# Altium schematic sheet Steering PCB.SchDoc
size B; Organization: Altium Limited; Address1: L3, 12a Rodborough Rd; Address2: Frenchs Forest; Address3: NSW; Address4: Australia 2086
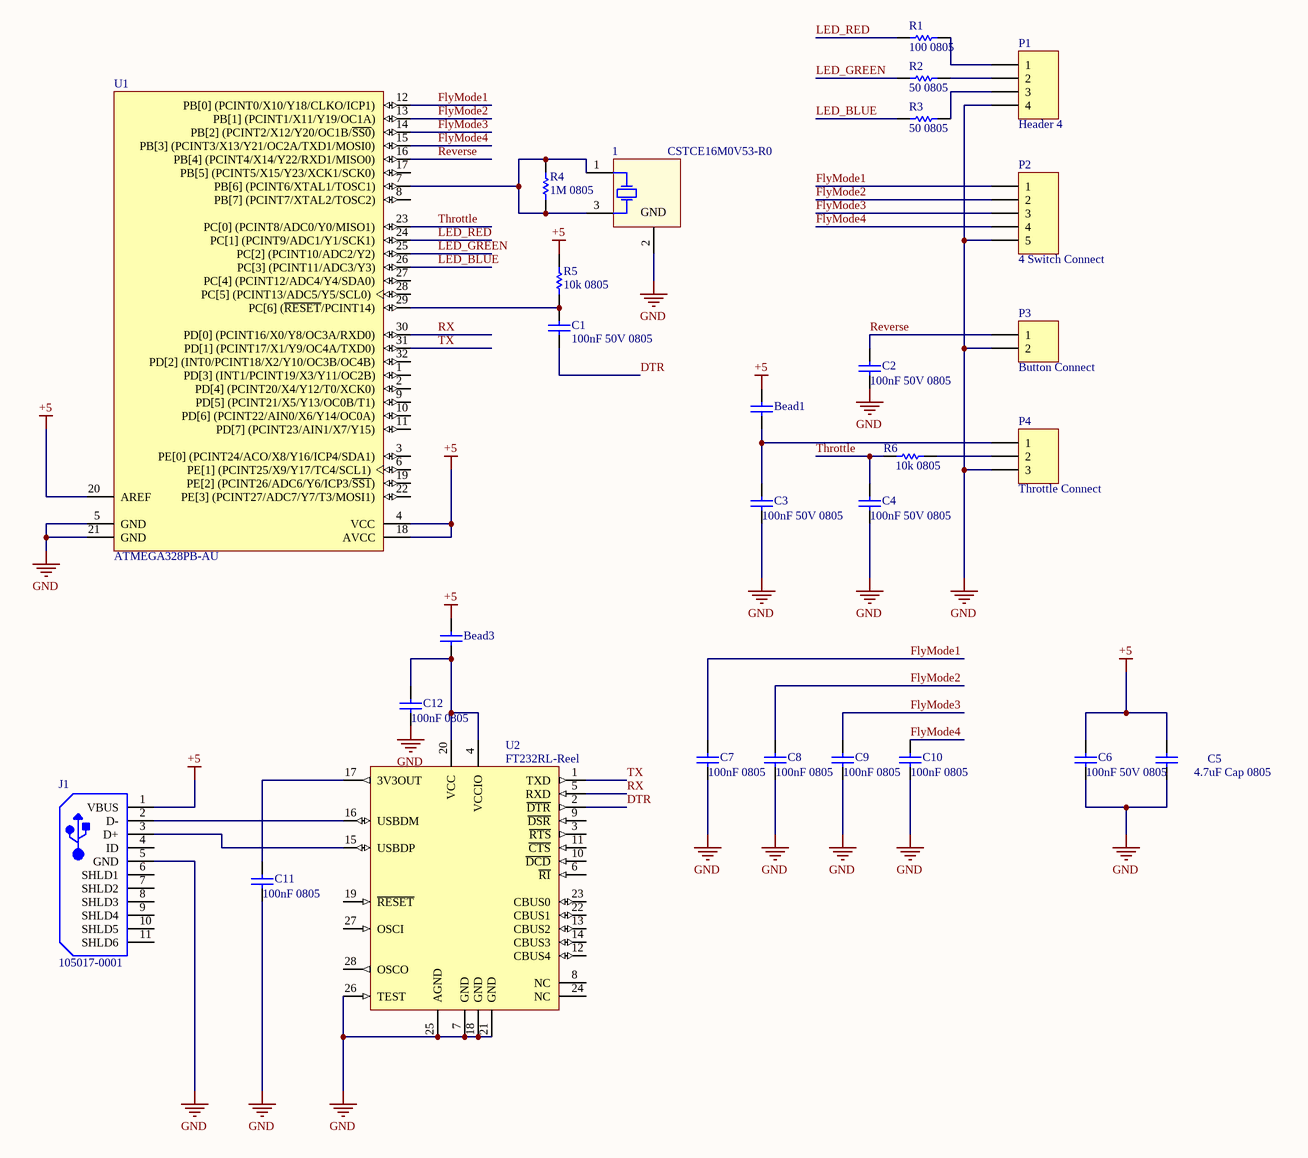
[diagram p0: Steering PCB.SchDoc]

## Parts
1  CSTCE16M0V53-R0  [MURA-CSTCE_V-3_V]
Bead1  100nF 50V 0805  [0805C_L]  (value not drawn)
Bead3  100nF 50V 0805  [0805C_L]  (value not drawn)
C1  100nF 50V 0805  [0805C_L]
C2  100nF 50V 0805  [0805C_L]
C3  100nF 50V 0805  [0805C_L]
C4  100nF 50V 0805  [0805C_L]
C5  4.7uF Cap 0805  [0805C_L]
C6  100nF 50V 0805  [0805C_L]
C7  100nF 0805  [0805C_L]
C8  100nF 0805  [0805C_L]
C9  100nF 0805  [0805C_L]
C10  100nF 0805  [0805C_L]
C11  100nF 0805  [0805C_L]
C12  100nF 0805  [0805C_L]
J1  105017-0001  [USB-MICRO-B_V]
P1  Header 4  [HDR1X4]
P2  4 Switch Connect  [HDR1X5]
P3  Button Connect  [HDR1X2]
P4  Throttle Connect  [HDR1X3]
R1  100 0805  [RESC0805(2012)_M]
R2  50 0805  [RESC0805(2012)_M]
R3  50 0805  [RESC0805(2012)_M]
R4  1M 0805  [RESC0805(2012)_M]
R5  10k 0805  [RESC0805(2012)_M]
R6  10k 0805  [RESC0805(2012)_M]
U1  ATMEGA328PB-AU  [ATML-32A_L]
U2  FT232RL-Reel  [SSOP-28_N]

## Nets
+5: Bead1.2 Bead3.2 C5.2 C6.2 J1.1(VBUS) R5.2 U1.4(VCC) U1.18(AVCC) U1.20(AREF)
GND: 1.2(GND) C2.1 C3.1 C4.1 C5.1 C6.1 C7.1 C8.1 C9.1 C10.1 C11.1 C12.1 J1.5(GND) P1.4 P2.5 P3.2 P4.3 U1.5(GND) U1.21(GND) U2.7(GND) U2.18(GND) U2.21(GND) U2.25(AGND) U2.26(TEST)
DTR: C1.1 U2.2(~{DTR})
FlyMode1: C7.2 P2.1 U1.12(PB[0]_(PCINT0/X10/Y18/CLKO/ICP1))
FlyMode2: C8.2 P2.2 U1.13(PB[1]_(PCINT1/X11/Y19/OC1A))
FlyMode3: C9.2 P2.3 U1.14(PB[2]_(PCINT2/X12/Y20/OC1B/~{SS0}))
FlyMode4: C10.2 P2.4 U1.15(PB[3]_(PCINT3/X13/Y21/OC2A/TXD1/MOSI0))
LED_BLUE: R3.2 U1.26(PC[3]_(PCINT11/ADC3/Y3))
LED_GREEN: R2.2 U1.25(PC[2]_(PCINT10/ADC2/Y2))
LED_RED: R1.2 U1.24(PC[1]_(PCINT9/ADC1/Y1/SCK1))
Reverse: C2.2 P3.1 U1.16(PB[4]_(PCINT4/X14/Y22/RXD1/MISO0))
RX: U1.30(PD[0]_(PCINT16/X0/Y8/OC3A/RXD0)) U2.5(RXD)
Throttle: C4.2 R6.2 U1.23(PC[0]_(PCINT8/ADC0/Y0/MISO1))
TX: U1.31(PD[1]_(PCINT17/X1/Y9/OC4A/TXD0)) U2.1(TXD)
Net1_1: 1.1(C1) 1.3(C2) R4.1 R4.2 U1.7(PB[6]_(PCINT6/XTAL1/TOSC1))
NetBead1_1: Bead1.1 C3.2 P4.1
NetBead3_1: Bead3.1 C12.2 U2.4(VCCIO) U2.20(VCC)
NetC1_2: C1.2 R5.1 U1.29(PC[6]_(~{RESET}/PCINT14))
NetC11_2: C11.2 U2.17(3V3OUT)
NetJ1_2: J1.2(D-) U2.16(USBDM)
NetJ1_3: J1.3(D+) U2.15(USBDP)
NetP1_1: P1.1 R1.1
NetP1_2: P1.2 R2.1
NetP1_3: P1.3 R3.1
NetP4_2: P4.2 R6.1

Not connected (* = marked no-connect by the designer): J1 4(ID) 6(SHLD1) 7(SHLD2) 8(SHLD3) 9(SHLD4) 10(SHLD5) 11(SHLD6); U1 1(PD[3]_(INT1/PCINT19/X3/Y11/OC2B)) 2(PD[4]_(PCINT20/X4/Y12/T0/XCK0)) 3(PE[0]_(PCINT24/ACO/X8/Y16/ICP4/SDA1)) 6(PE[1]_(PCINT25/X9/Y17/TC4/SCL1)) 8(PB[7]_(PCINT7/XTAL2/TOSC2)) 9(PD[5]_(PCINT21/X5/Y13/OC0B/T1)) 10(PD[6]_(PCINT22/AIN0/X6/Y14/OC0A)) 11(PD[7]_(PCINT23/AIN1/X7/Y15)) 17(PB[5]_(PCINT5/X15/Y23/XCK1/SCK0)) 19(PE[2]_(PCINT26/ADC6/Y6/ICP3/~{SS1})) 22(PE[3]_(PCINT27/ADC7/Y7/T3/MOSI1)) 27(PC[4]_(PCINT12/ADC4/Y4/SDA0)) 28(PC[5]_(PCINT13/ADC5/Y5/SCL0)) 32(PD[2]_(INT0/PCINT18/X2/Y10/OC3B/OC4B)); U2 3(~{RTS}) 6(~{RI}) 8(NC) 9(~{DSR}) 10(~{DCD}) 11(~{CTS}) 12(CBUS4) 13(CBUS2) 14(CBUS3) 19(~{RESET}) 22(CBUS1) 23(CBUS0) 24(NC) 27(OSCI) 28(OSCO)

## Notes on the sheet
- Title
- Size:
- Date:
- B
- Number:
- Time:
- Revision:
- Sheet
- of
- File:

## Library data of the parts
1 = CMP-0588-00001-1: Ceramic Resonator, 16 MHz with Built-in Capacitance, Thickness Expander Mode, Initial Frequency Tolerance +/- 0.5%, Load Capacity 15 pF, -20 to 80 degC, 3.2 x 1.3 x 1 mm SMD, RoHS, Reel; Manufacturer: Murata; Oscillating Frequency: 16 MHz; Load Capacity: 15 pF; ComponentLink2Description: Datasheet; RoHS: TRUE; Operating Temperature Range: -20 to 80 degC; Mounting Technology: Surface Mount; PackageReference: CSTCE_V-3; Packing: Reel; ComponentLink2URL: http://www.murata.com/products/catalog/pdf/p16e.pdf; ComponentLink1URL: http://www.murata.com/; ComponentLink1Description: Manufacturer URL; DatasheetVersion: Rev. P16E-22; Initial Tolerance: +/- 0.5%; PackageDescription: 3-Pin SMD, Body 3.2 x 1.3 mm, Pitch 0.95 mm; PartNumber: CSTCE16M0V53-R0; Initial Frequency Tolerance: +/- 0.5%
Bead1 Bead3 C1-C4 C6 = Cap100nF_50V_0805: Manufacturer: Yageo; Manufacturer Part Number: CC0805ZRY5V9BB104; Capacitance: 0.1µF; Tolerance: -20%, +80%; Temperature Coefficient: Y5V (F); Catalog Drawings: CC_0805_0.6; Featured Product: Commodity Multilayer Ceramic Capacitors – CC Series; Online Catalog: CC Series; Other Names: 311-1361-6; Supplier 1: Ciiva; Category: Capacitors; Stock 1: 389325; Pricing 1: 1=0.1, 10=0.033, 25=0.0232, 100=0.0151, 250=0.0123, 500=0.0106, 1000=0.0082 (USD); Packaging: Digi-Reel®; Voltage - Rated: 50V; Operating Temperature: -30°C ~ 85°C; Features: -; Ratings: -; Applications: General Purpose; Mounting Type: Surface Mount, MLCC; Package / Case: 0805 (2012 Metric); Size / Dimension: 0.079" L x 0.049" W (2.00mm x 1.25mm); Height - Seated (Max): -; Thickness (Max): 0.024" (0.60mm); Lead Spacing: -; Lead Style: -; ComponentLink1URL: https://datasheet.ciiva.com/11465/upy-gphc-y5v-6-3v-to-50v-5-11465865.pdf; ComponentLink1Description: https://datasheet.ciiva.com/11465/upy-gphc-y5v-6-3v-to-50v-5-11465865.pdf; Supplier Part Number 1: 311-1361-1-ND; Standard Package: 1; Family: Ceramic Capacitors; Series: CC; ComponentLink2URL: https://datasheet.ciiva.com/13389/upy-gp-np0-16v-to-50v-8-13389351.pdf; ComponentLink2Description: https://datasheet.ciiva.com/13389/upy-gp-np0-16v-to-50v-8-13389351.pdf; ComponentLink3URL: https://datasheet.ciiva.com/29241/445331-da-01-en-kerko-chip-0805-y5v0-1uf-20-80proz50vg-29241946.pdf; ComponentLink3Description: https://datasheet.ciiva.com/29241/445331-da-01-en-kerko-chip-0805-y5v0-1uf-20-80proz50vg-29241946.pdf; ComponentLink4URL: https://datasheet.ciiva.com/17435/upy-gphc-y5v-6-3v-to-50v-5-17435053.pdf; ComponentLink4Description: https://datasheet.ciiva.com/17435/upy-gphc-y5v-6-3v-to-50v-5-17435053.pdf; ComponentLink5URL: https://datasheet.ciiva.com/16747/upy-gphc-y5v-6-3v-to-50v-5-revised-16747323.pdf; ComponentLink5Description: https://datasheet.ciiva.com/16747/upy-gphc-y5v-6-3v-to-50v-5-revised-16747323.pdf; ComponentLink6URL: https://datasheet.ciiva.com/144/mlccorderingcode-144210.pdf; ComponentLink6Description: https://datasheet.ciiva.com/144/mlccorderingcode-144210.pdf; ComponentLink7URL: https://datasheet.ciiva.com/144/mlccorderingcode-144209.pdf; ComponentLink7Description: https://datasheet.ciiva.com/144/mlccorderingcode-144209.pdf; ComponentLink8URL: https://datasheet.ciiva.com/144/mlccorderingcode-144211.pdf; ComponentLink8Description: https://datasheet.ciiva.com/144/mlccorderingcode-144211.pdf; ComponentLink9URL: https://datasheet.ciiva.com/28450/1132289-28450870.pdf; ComponentLink9Description: https://datasheet.ciiva.com/28450/1132289-28450870.pdf; ComponentLink10URL: https://datasheet.ciiva.com/15189/getdatasheetpartid-55882-15189238.pdf; ComponentLink10Description: https://datasheet.ciiva.com/15189/getdatasheetpartid-55882-15189238.pdf
C5 C7-C12 = Cap100nF_50V_0805: Manufacturer: Yageo; Manufacturer Part Number: CC0805ZRY5V9BB104; Capacitance: 0.1µF; Tolerance: -20%, +80%; Voltage - Rated: 50V; Temperature Coefficient: Y5V (F); Catalog Drawings: CC_0805_0.6; Featured Product: Commodity Multilayer Ceramic Capacitors – CC Series; Online Catalog: CC Series; Other Names: 311-1361-6; Supplier 1: Ciiva; Category: Capacitors; Stock 1: 389325; Pricing 1: 1=0.1, 10=0.033, 25=0.0232, 100=0.0151, 250=0.0123, 500=0.0106, 1000=0.0082 (USD); Packaging: Digi-Reel®; Operating Temperature: -30°C ~ 85°C; Features: -; Ratings: -; Applications: General Purpose; Mounting Type: Surface Mount, MLCC; Package / Case: 0805 (2012 Metric); Size / Dimension: 0.079" L x 0.049" W (2.00mm x 1.25mm); Height - Seated (Max): -; Thickness (Max): 0.024" (0.60mm); Lead Spacing: -; Lead Style: -; ComponentLink1URL: https://datasheet.ciiva.com/11465/upy-gphc-y5v-6-3v-to-50v-5-11465865.pdf; ComponentLink1Description: https://datasheet.ciiva.com/11465/upy-gphc-y5v-6-3v-to-50v-5-11465865.pdf; Supplier Part Number 1: 311-1361-1-ND; Standard Package: 1; Family: Ceramic Capacitors; Series: CC; ComponentLink2URL: https://datasheet.ciiva.com/13389/upy-gp-np0-16v-to-50v-8-13389351.pdf; ComponentLink2Description: https://datasheet.ciiva.com/13389/upy-gp-np0-16v-to-50v-8-13389351.pdf; ComponentLink3URL: https://datasheet.ciiva.com/29241/445331-da-01-en-kerko-chip-0805-y5v0-1uf-20-80proz50vg-29241946.pdf; ComponentLink3Description: https://datasheet.ciiva.com/29241/445331-da-01-en-kerko-chip-0805-y5v0-1uf-20-80proz50vg-29241946.pdf; ComponentLink4URL: https://datasheet.ciiva.com/17435/upy-gphc-y5v-6-3v-to-50v-5-17435053.pdf; ComponentLink4Description: https://datasheet.ciiva.com/17435/upy-gphc-y5v-6-3v-to-50v-5-17435053.pdf; ComponentLink5URL: https://datasheet.ciiva.com/16747/upy-gphc-y5v-6-3v-to-50v-5-revised-16747323.pdf; ComponentLink5Description: https://datasheet.ciiva.com/16747/upy-gphc-y5v-6-3v-to-50v-5-revised-16747323.pdf; ComponentLink6URL: https://datasheet.ciiva.com/144/mlccorderingcode-144210.pdf; ComponentLink6Description: https://datasheet.ciiva.com/144/mlccorderingcode-144210.pdf; ComponentLink7URL: https://datasheet.ciiva.com/144/mlccorderingcode-144209.pdf; ComponentLink7Description: https://datasheet.ciiva.com/144/mlccorderingcode-144209.pdf; ComponentLink8URL: https://datasheet.ciiva.com/144/mlccorderingcode-144211.pdf; ComponentLink8Description: https://datasheet.ciiva.com/144/mlccorderingcode-144211.pdf; ComponentLink9URL: https://datasheet.ciiva.com/28450/1132289-28450870.pdf; ComponentLink9Description: https://datasheet.ciiva.com/28450/1132289-28450870.pdf; ComponentLink10URL: https://datasheet.ciiva.com/15189/getdatasheetpartid-55882-15189238.pdf; ComponentLink10Description: https://datasheet.ciiva.com/15189/getdatasheetpartid-55882-15189238.pdf
J1 = CMP-2000-05827-1: Micro-USB B Receptacle, Right Angle, Bottom Mount, Surface Mount, with Solder Tabs, -30 to 85 degC, 5-Pin USB, RoHS, Tape and Reel; Manufacturer: Molex; Featured Product: Micro-USBConnectorsUSBConnectors; Other Names: WM1399DKR; Package Version: Rev. F, 12/2012; Number of Contacts: 5; Connector Type: USB-microB; Catalog Drawings: 1050170001; 3D Model: 105017-0001.stp; Mating Products: WM17145-ND-CABLEMICROUSBBTOSTDA1.0MWM17147-ND-CABLEMICROUSBBTOSTDA2.0MWM17146-ND-CABLEMICROUSBBTOSTDA1.5M; PCN Assembly/Origin: ResinSupplier21/Oct/2015; Voltage - Max: 30V; Online Catalog: Molex-MicroUSB; Manufacturer URL: http://www.molex.com/; Package Description: 5-Leads USB, Micro B, Body 7.5 x 5 mm, Pitch 0.65 mm; Datasheet URL: http://www.molex.com/elqNow/elqRedir.htm?ref=http://www.molex.com/webdocs/datasheets/pdf/en-us/1050170001_IO_CONNECTORS.pdf; Ingress Protection: -; Datasheet Version: 03/2016; Mounting Type: BoardCutout,SurfaceMount,RightAngle; Circuits: 5; Standard Package: 1; Package Reference: MICRO-B; Package URL: http://www.molex.com/pdm_docs/sd/1050170001_sd.pdf; Category: Connectors,Interconnects; Series: -; RoHS Information: 1050170001CertofCompliance; Features: Shielded,SolderRetention; Family: USB,DVI,HDMIConnectors; Specifications: -; Gender: Receptacle; Packaging: Digi-Reel®; Mounting Technology: SurfaceMount
P1 = Header 4: Header, 4-Pin; LatestRevisionDate: 17-Jul-2002; LatestRevisionNote: Re-released for DXP Platform.; Publisher: Altium Limited
P2 = Header 5: Header, 5-Pin; LatestRevisionDate: 17-Jul-2002; LatestRevisionNote: Re-released for DXP Platform.; Publisher: Altium Limited
P3 = Header 2: Header, 2-Pin; LatestRevisionDate: 17-Jul-2002; LatestRevisionNote: Re-released for DXP Platform.; Publisher: Altium Limited
P4 = Header 3: Header, 3-Pin; LatestRevisionDate: 17-Jul-2002; LatestRevisionNote: Re-released for DXP Platform.; Publisher: Altium Limited
R1-R6 = CMP-1013-00351-1: 39R2 0.125W 1% 0805 (2012 Metric)  SMD; Case-EIA: 0805; Value: 39.20 Ohm; Case-Metric: 2012; Tolerance: 1 %; Technology: SMT; Power: 0.125 W
U1 = CMP-2000-07439-1: AVR Microcontroller, 1.8 to 5.5 V, 32 KB Flash, 1 KB EEPROM, 2 KB SRAM, -40 to 85 degC, 32-Pin TQFP (32A), RoHS, Tray; Manufacturer: Microchip; Datasheet URL: http://ww1.microchip.com/downloads/en/DeviceDoc/40001906A.pdf; Mounting Technology: SurfaceMount; RoHSCompliant: false; Manufacturer URL: http://www.microchip.com/; Package Description: 32-Pin Thin Profile Plastic Quad Flat Package, Body 7 x 7 mm, Pitch 0.8 mm; Package Reference: 32A; Datasheet Version: Rev. A, 04/2017
U2 = CMP-0078-00029-2: USB UART Asynchronous Serial Data Transfer Chip, SSOP-28, Tape and Reel; RevisionNote: URLs added.; ComponentLink2URL: http://www.ftdichip.com/Support/Documents/DataSheets/ICs/DS_FT232R.pdf; PackageDescription: 28-Pin Small Outline Package 0.65 mm Pitch; ComponentLink1Description: Manufacturer URL; PackageVersion: 2010; ComponentLink2Description: Datasheet; PackageReference: SSOP-28; DatasheetVersion: ver 2.09, Apr-2011; ComponentLink1URL: http://www.ftdichip.com/